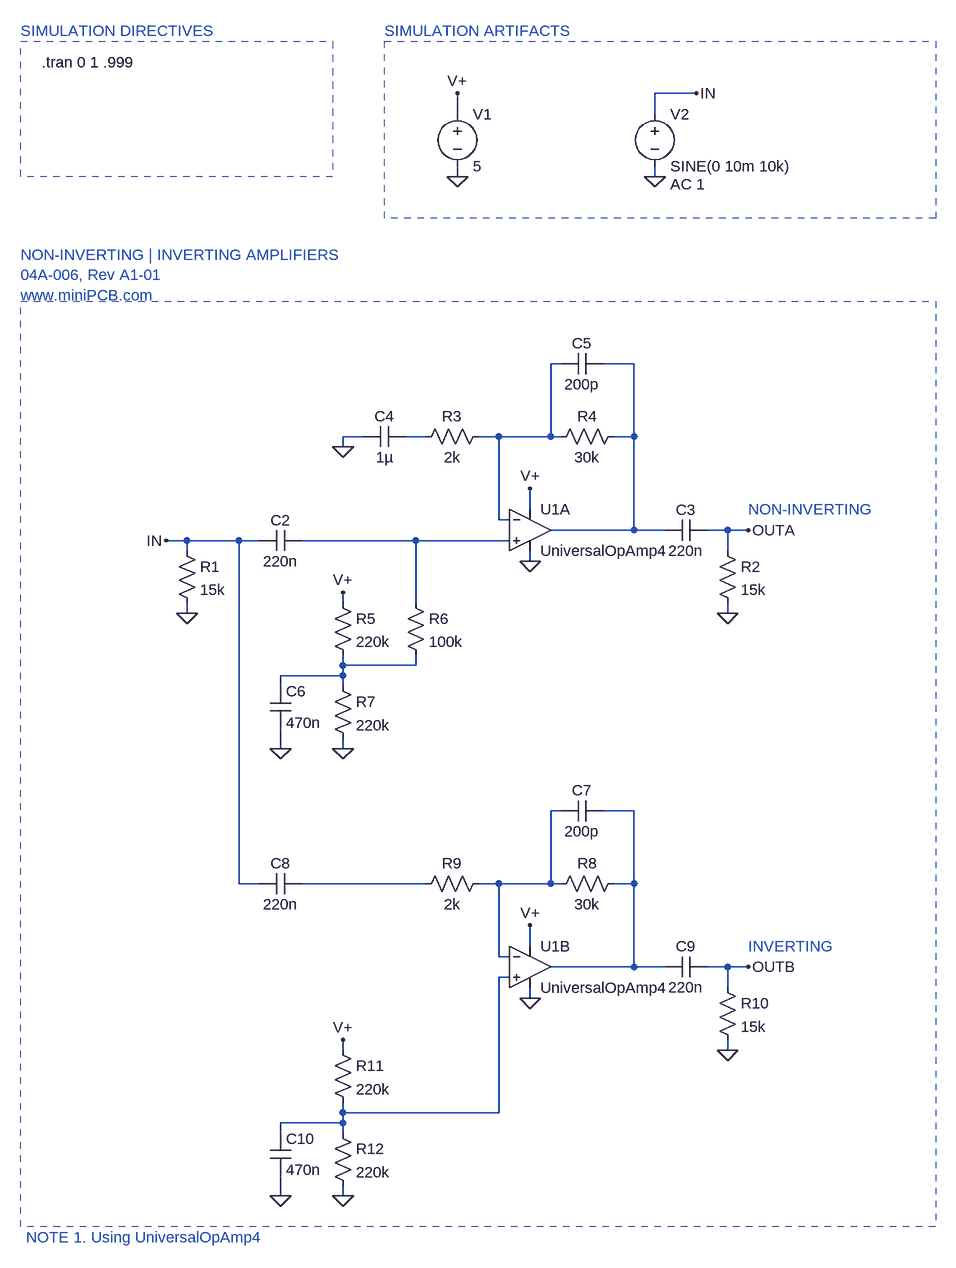
[diagram p0: schematic 04A-006.asc]
04A-006.asc, the LTspice schematic file:
Version 4.1
SHEET 1 1412 1200
WIRE 656 -576 592 -576
WIRE 288 -544 288 -576
WIRE 592 -544 592 -576
WIRE 288 -448 288 -464
WIRE 592 -448 592 -464
WIRE 448 -160 432 -160
WIRE 560 -160 512 -160
WIRE 144 -48 112 -48
WIRE 240 -48 208 -48
WIRE 352 -48 320 -48
WIRE 432 -48 432 -160
WIRE 432 -48 352 -48
WIRE 448 -48 432 -48
WIRE 560 -48 560 -160
WIRE 560 -48 528 -48
WIRE 112 -32 112 -48
WIRE 400 64 400 32
WIRE 352 80 352 -48
WIRE 368 80 352 80
WIRE 560 96 560 -48
WIRE 560 96 432 96
WIRE 608 96 560 96
WIRE 704 96 672 96
WIRE 736 96 704 96
WIRE -128 112 -160 112
WIRE -48 112 -128 112
WIRE -16 112 -48 112
WIRE 224 112 48 112
WIRE 368 112 224 112
WIRE -128 128 -128 112
WIRE 704 128 704 96
WIRE 400 144 400 128
WIRE 112 208 112 192
WIRE 224 208 224 112
WIRE -128 224 -128 208
WIRE 704 224 704 208
WIRE 112 304 112 288
WIRE 224 304 224 288
WIRE 224 304 112 304
WIRE 112 320 112 304
WIRE 112 320 16 320
WIRE 16 336 16 320
WIRE 112 336 112 320
WIRE 16 432 16 400
WIRE 112 432 112 416
WIRE 448 528 432 528
WIRE 560 528 512 528
WIRE -48 640 -48 112
WIRE -16 640 -48 640
WIRE 240 640 48 640
WIRE 352 640 320 640
WIRE 432 640 432 528
WIRE 432 640 352 640
WIRE 448 640 432 640
WIRE 560 640 560 528
WIRE 560 640 528 640
WIRE 400 736 400 704
WIRE 352 752 352 640
WIRE 368 752 352 752
WIRE 560 768 560 640
WIRE 560 768 432 768
WIRE 608 768 560 768
WIRE 704 768 672 768
WIRE 736 768 704 768
WIRE 368 784 352 784
WIRE 704 800 704 768
WIRE 400 816 400 800
WIRE 112 896 112 880
WIRE 704 896 704 880
WIRE 112 992 112 976
WIRE 352 992 352 784
WIRE 352 992 112 992
WIRE 112 1008 112 992
WIRE 112 1008 16 1008
WIRE 16 1024 16 1008
WIRE 112 1024 112 1008
WIRE 16 1120 16 1088
WIRE 112 1120 112 1104
FLAG 288 -448 0
FLAG 592 -448 0
FLAG 400 144 0
FLAG 400 816 0
FLAG 400 704 V+
FLAG 400 32 V+
FLAG 288 -576 V+
FLAG 656 -576 IN
FLAG 16 432 0
FLAG 112 432 0
FLAG 112 192 V+
FLAG 704 224 0
FLAG 736 96 OUTA
FLAG 112 -32 0
FLAG -128 224 0
FLAG -160 112 IN
FLAG 16 1120 0
FLAG 112 1120 0
FLAG 112 880 V+
FLAG 704 896 0
FLAG 736 768 OUTB
SYMBOL voltage 288 -560 R0
WINDOW 123 0 0 Left 0
WINDOW 39 0 0 Left 0
SYMATTR InstName V1
SYMATTR Value 5
SYMBOL voltage 592 -560 R0
WINDOW 123 24 124 Left 2
WINDOW 39 0 0 Left 0
SYMATTR Value2 AC 1
SYMATTR InstName V2
SYMATTR Value SINE(0 10m 10k)
SYMBOL cap 48 96 R90
WINDOW 0 0 32 VBottom 2
WINDOW 3 32 32 VTop 2
SYMATTR InstName C2
SYMATTR Value 220n
SYMBOL res 96 192 R0
SYMATTR InstName R5
SYMATTR Value 220k
SYMBOL res 96 320 R0
SYMATTR InstName R7
SYMATTR Value 220k
SYMBOL cap 0 336 R0
SYMATTR InstName C6
SYMATTR Value 470n
SYMBOL res 208 192 R0
SYMATTR InstName R6
SYMATTR Value 100k
SYMBOL res 336 -64 R90
WINDOW 0 0 56 VBottom 2
WINDOW 3 32 56 VTop 2
SYMATTR InstName R3
SYMATTR Value 2k
SYMBOL res 544 -64 R90
WINDOW 0 0 56 VBottom 2
WINDOW 3 32 56 VTop 2
SYMATTR InstName R4
SYMATTR Value 30k
SYMBOL cap 512 -176 R90
WINDOW 0 0 32 VBottom 2
WINDOW 3 32 32 VTop 2
SYMATTR InstName C5
SYMATTR Value 200p
SYMBOL cap 672 80 R90
WINDOW 0 0 32 VBottom 2
WINDOW 3 32 32 VTop 2
SYMATTR InstName C3
SYMATTR Value 220n
SYMBOL res 688 112 R0
SYMATTR InstName R2
SYMATTR Value 15k
SYMBOL cap 208 -64 R90
WINDOW 0 0 32 VBottom 2
WINDOW 3 32 32 VTop 2
SYMATTR InstName C4
SYMATTR Value 1µ
SYMBOL res -144 112 R0
SYMATTR InstName R1
SYMATTR Value 15k
SYMBOL res 96 880 R0
SYMATTR InstName R11
SYMATTR Value 220k
SYMBOL res 96 1008 R0
SYMATTR InstName R12
SYMATTR Value 220k
SYMBOL cap 0 1024 R0
SYMATTR InstName C10
SYMATTR Value 470n
SYMBOL res 336 624 R90
WINDOW 0 0 56 VBottom 2
WINDOW 3 32 56 VTop 2
SYMATTR InstName R9
SYMATTR Value 2k
SYMBOL res 544 624 R90
WINDOW 0 0 56 VBottom 2
WINDOW 3 32 56 VTop 2
SYMATTR InstName R8
SYMATTR Value 30k
SYMBOL cap 512 512 R90
WINDOW 0 0 32 VBottom 2
WINDOW 3 32 32 VTop 2
SYMATTR InstName C7
SYMATTR Value 200p
SYMBOL cap 48 624 R90
WINDOW 0 0 32 VBottom 2
WINDOW 3 32 32 VTop 2
SYMATTR InstName C8
SYMATTR Value 220n
SYMBOL cap 672 752 R90
WINDOW 0 0 32 VBottom 2
WINDOW 3 32 32 VTop 2
SYMATTR InstName C9
SYMATTR Value 220n
SYMBOL res 688 784 R0
SYMATTR InstName R10
SYMATTR Value 15k
SYMBOL OpAmps\\UniversalOpAmp4 400 96 R0
SYMATTR InstName U1A
SYMBOL OpAmps\\UniversalOpAmp4 400 768 R0
SYMATTR InstName U1B
TEXT -352 -624 Left 2 !.tran 0 1 .999
TEXT -384 -328 Left 2 ;NON-INVERTING | INVERTING AMPLIFIERS\n04A-006, Rev A1-01\nwww.miniPCB.com
TEXT -384 -672 Left 2 ;SIMULATION DIRECTIVES
TEXT 176 -672 Left 2 ;SIMULATION ARTIFACTS
TEXT -376 1184 Left 2 ;NOTE 1. Using UniversalOpAmp4
TEXT 736 64 Left 2 ;NON-INVERTING
TEXT 736 736 Left 2 ;INVERTING
RECTANGLE Normal 96 -448 -384 -656 2
RECTANGLE Normal 1024 1168 -384 -256 2
RECTANGLE Normal 1024 -384 176 -656 2

The netlist it stands for:
* 04A-006.asc
V1 V+ 0 5
V2 IN 0 SINE(0 10m 10k) AC 1
C2 N004 IN 220n
R5 V+ N005 220k
R7 N005 0 220k
C6 N005 0 470n
R6 N004 N005 100k
R3 N001 N003 2k
R4 N002 N001 30k
C5 N002 N001 200p
C3 OUTA N002 220n
R2 OUTA 0 15k
C4 N003 0 1µ
R1 IN 0 15k
R11 V+ N009 220k
R12 N009 0 220k
C10 N009 0 470n
R9 N006 N008 2k
R8 N007 N006 30k
C7 N007 N006 200p
C8 N008 IN 220n
C9 OUTB N007 220n
R10 OUTB 0 15k
* U1A: UniversalOpAmp4 (symbol OpAmps\UniversalOpAmp4 not available, pins judged from their places): In+=N004 In-=N001 V+=V+ V-=0 OUT=N002
* U1B: UniversalOpAmp4 (symbol OpAmps\UniversalOpAmp4 not available, pins judged from their places): In+=N009 In-=N006 V+=V+ V-=0 OUT=N007
.tran 0 1 .999
* NON-INVERTING | INVERTING AMPLIFIERS
* 04A-006, Rev A1-01
* www.miniPCB.com
* SIMULATION DIRECTIVES
* SIMULATION ARTIFACTS
* NOTE 1. Using UniversalOpAmp4
* NON-INVERTING
* INVERTING
.backanno
.end